# EAGLE design ttl2rs232 (EAGLE 9.6.2)
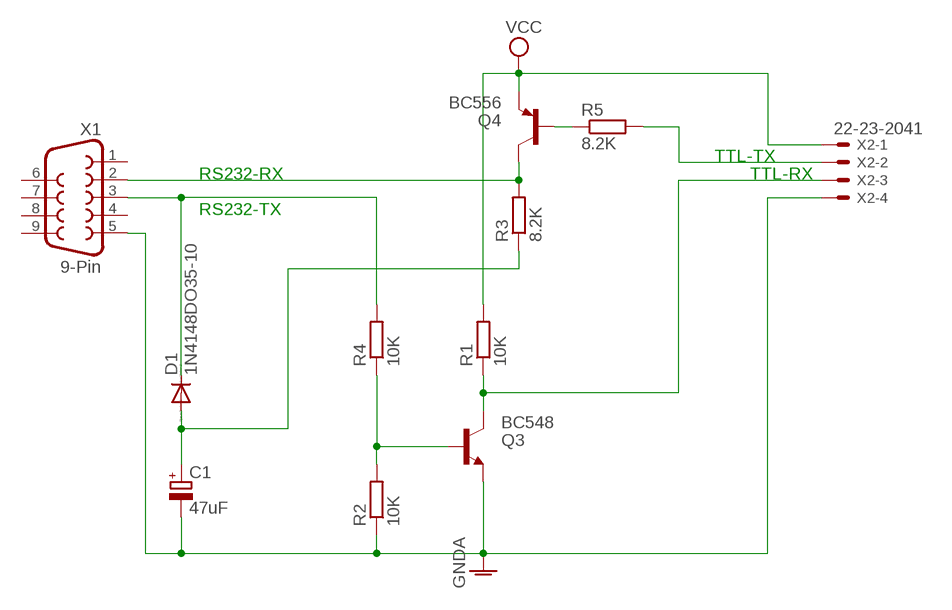
[diagram p0: schematic, sheet 1]

## Parts
C1  47uF  CPOL-EUE2.5-7  [E2,5-7]
D1  1N4148DO35-10  [DO35-10]
Q3  BC548  [TO92-EBC]
Q4  BC556  [TO92-EBC]
R1  10K  R-EU_0207/10  [0207/10]
R2  10K  R-EU_0207/10  [0207/10]
R3  8.2K  R-EU_0207/10  [0207/10]
R4  10K  R-EU_0207/10  [0207/10]
R5  8.2K  R-EU_0207/10  [0207/10]
X1  9-Pin  F09H  [F09H]
X2  22-23-2041  [22-23-2041]

## Nets
GNDA: C1.- Q3.E R2.1 X1.5 X2.4
N$1: Q3.C R1.1 X2.3
N$2: Q3.B R2.2 R4.1
N$3: C1.+ D1.A R3.1
N$4: D1.C R4.2 X1.3
N$5: Q4.C R3.2 X1.2
N$6: Q4.B R5.1
N$9: R5.2 X2.2
VCC: Q4.E R1.2 X2.1
Unconnected: X1.1 X1.4 X1.6 X1.7 X1.8 X1.9

## Notes on the sheet
- TTL-TX
- RS232-RX | TTL-RX
- RS232-TX

## Library data of the parts
C1 = resistor:CPOL-EU: POLARIZED CAPACITOR, European symbol
D1 = diode:1N4148: DIODE high speed (Philips)
Q3 = transistor-npn:BC548*: NPN Transistor
Q4 = transistor-pnp:BC556*: PNP Transistror
R1-R5 = resistor:R-EU_: RESISTOR, European symbol
X1 = con-subd:F09: SUB-D; OC_FARNELL: unknown; OC_NEWARK: unknown
X2 = con-molex:22-23-2041: .100" (2.54mm) Center Header - 4 Pin; MF: MOLEX; MPN: 22-23-2041; OC_FARNELL: 1462920; OC_NEWARK: 38C0355

## Board
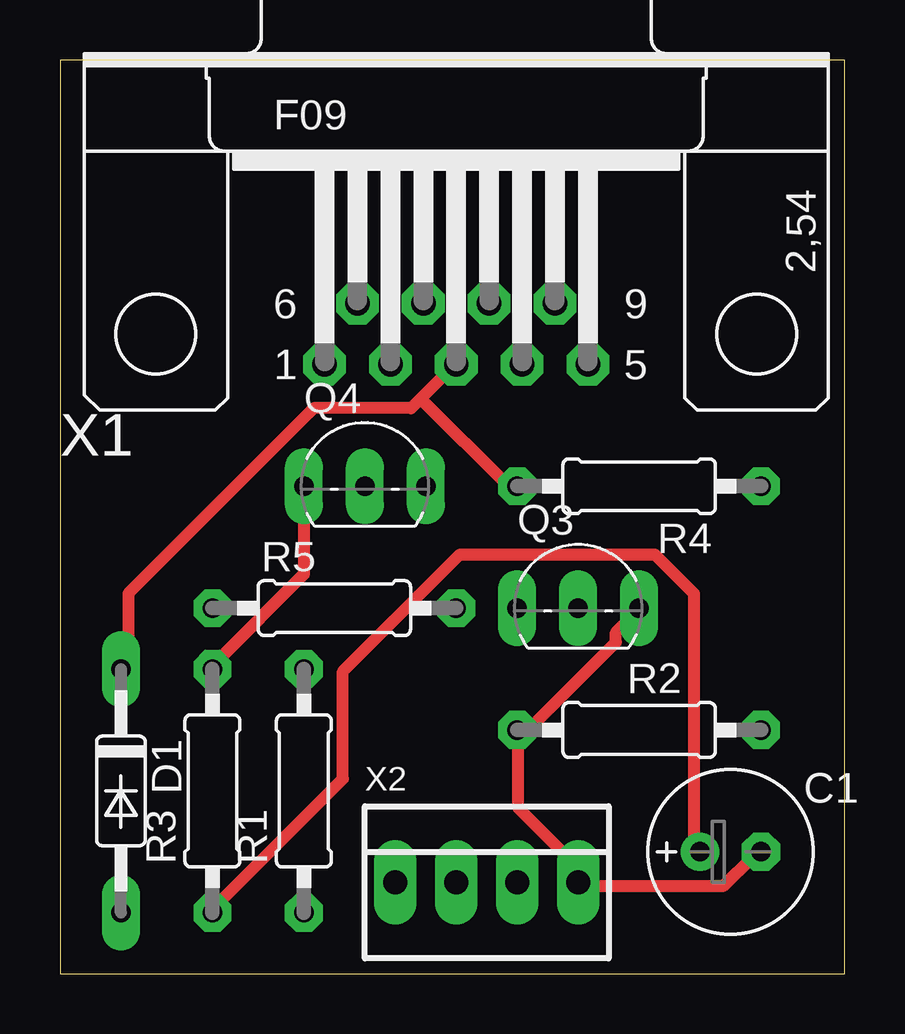
[diagram p1: board, top side]
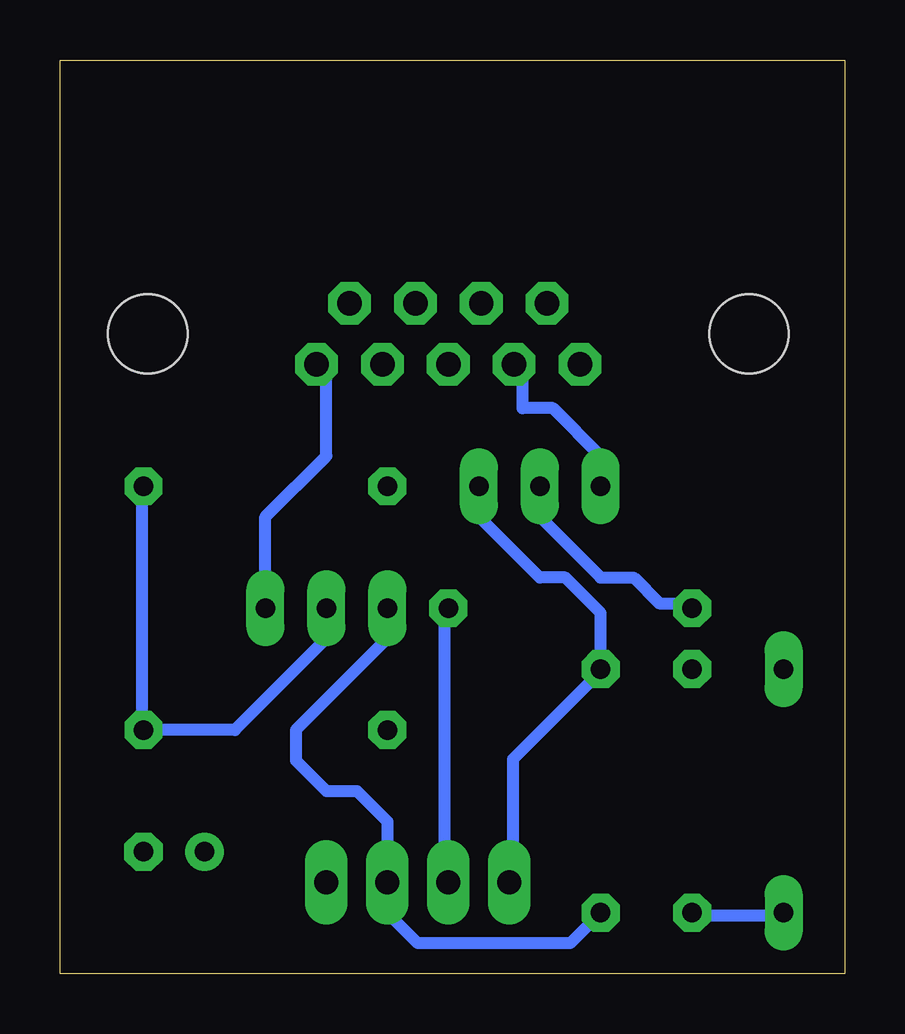
[diagram p2: board, bottom side, seen from below]

Size 32.69 x 38.09 mm. Coordinates in mm from the lower left corner, seen from the top.
Outline: 0,0 32.69,0 32.69,38.09 0,38.09 0,0
Copper layers (1*16): Top 0.035mm / dielectric 1.5mm / Bottom 0.035mm
Design rules "default *": minimum track width 20mil, minimum drill 0.35mm, track to track 12mil, track to pad 12mil, pad to pad 12mil, via to via 12mil, smd to smd 6mil, copper to edge 40mil, drill to drill 12mil, minimum pad ring 15mil, minimum via ring 15mil, stop-mask expansion 4mil, vias tented up to drill 0mil, thermal gap 10mil

### Footprints (pad centres in the part's own frame; a part is rotated, then mirrored left to right if it is on the bottom)
E2,5-7 = drill 0.813 pad 1.6: + -1.27,0 | drill 0.813 pad 1.6 octagon: - 1.27,0
DO35-10 = drill 0.813 long: A 5.08,0; C -5.08,0
TO92-EBC = drill 0.813 long: B 0,-1.27; C -2.54,-1.27; E 2.54,-1.27
0207/10 = drill 0.813 octagon: 1 -5.08,0; 2 5.08,0
F09H = drill 1.016 octagon: 1 -5.486,-1.27; 2 -2.743,-1.27; 3 0,-1.27; 4 2.743,-1.27; 5 5.486,-1.27; 6 -4.115,1.27; 7 -1.372,1.27; 8 1.372,1.27; 9 4.115,1.27 | hole 3.302: -12.522,0; 12.522,0
22-23-2041 = drill 1 long: 1 -3.81,0; 2 -1.27,0; 3 1.27,0; 4 3.81,0

### Placement (x,y rotation side)
C1  27.94,5.08 0 top
D1  2.54,7.62 270 top
Q3  21.59,16.51 0 top
Q4  12.7,21.59 0 top
R1  10.16,7.62 90 top
R2  24.13,10.16 0 top
R3  6.35,7.62 90 top
R4  24.13,20.32 180 top
R5  11.43,15.24 0 top
X1  16.51,26.67 0 top
X2  17.78,3.81 0 top

### Tracks (layer width: path | path; a pad name or v marks a point on that pad's centre or on a via)
GNDA
  Top 0.508: 19.1,9.75 19.1,6.91 21.95,4.06 X2.4 21.95,3.66 27.64,3.66 28.85,4.88 C1.- | 19.1,9.75 19.1,10.16 R2.1 19.1,9.75 | 19.1,9.75 23.16,13.82 23.16,14.22 23.98,15.04 Q3.E
  Bottom 0.508: Q3.E 24.13,19.05 21.59,21.59 21.59,24.99 X1.5
N$1
  Bottom 0.508: 10.16,2.44 R1.1 11.43,1.27 17.78,1.27 19.05,2.54 X2.3 | 19.1,3.66 X2.3 | 19.1,15.04 Q3.C 19.05,13.97 22.86,10.16 22.86,8.89 21.59,7.62 20.32,7.62 19.05,6.35 X2.3 | 19.1,4.06 X2.3
N$2
  Bottom 0.508: R4.1 29.26,20.32 29.26,10.16 R2.2 25.4,10.16 21.59,13.97 Q3.B
N$3
  Top 0.508: C1.+ 26.42,5.28 26.42,15.85 24.79,17.48 16.66,17.48 11.79,12.6 11.79,8.13 6.5,2.85 R3.1
  Bottom 0.508: D1.A 2.85,2.44 6.1,2.44 R3.1
N$4
  Top 0.508: 15.04,23.98 16.26,25.2 X1.3 | 15.04,23.98 14.63,23.57 10.57,23.57 2.85,15.85 2.85,13.01 D1.C | 15.04,23.98 18.69,20.32 R4.2
N$5
  Top 0.508: Q4.C 10.16,16.66 6.5,13.01 R3.2
  Bottom 0.508: X1.2 13.41,25.2 13.41,23.57 12.14,23.57 10.16,21.59 Q4.C
N$6
  Bottom 0.508: R5.1 6.5,15.44 7.72,15.44 8.79,16.51 10.16,16.51 12.7,19.05 Q4.B 12.6,20.32
N$9
  Bottom 0.508: R5.2 16.66,15.04 16.66,4.06 X2.2
VCC
  Bottom 0.508: 15.44,20.32 Q4.E 15.24,19.05 14.61,18.41 12.7,16.51 11.63,16.51 10.16,15.04 R1.2 10.16,12.6 13.82,8.94 13.82,4.06 X2.1